# EAGLE design V2c (EAGLE 6.5.0)
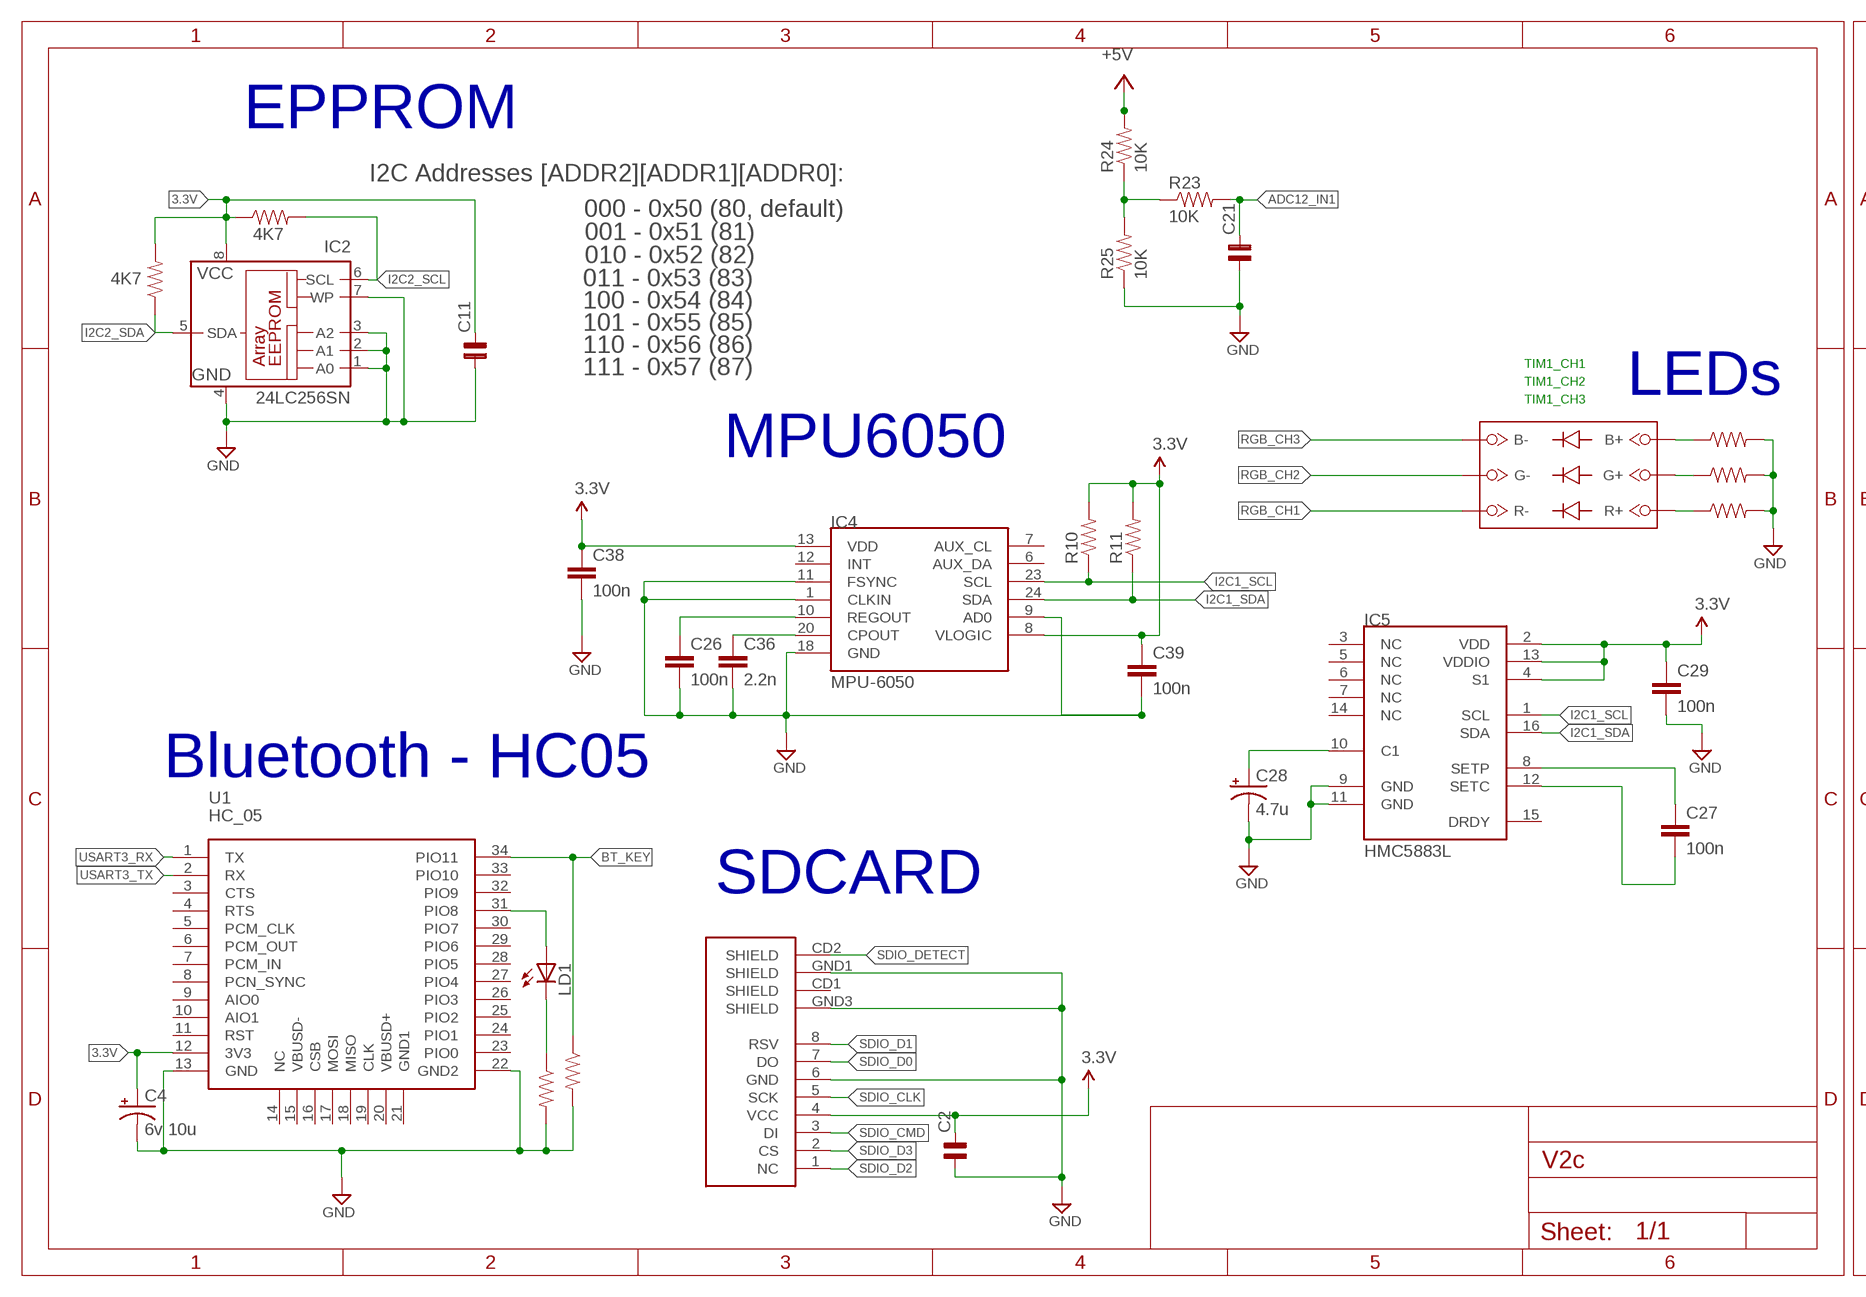
[diagram p0: schematic, sheet 1, part 1 of 2]
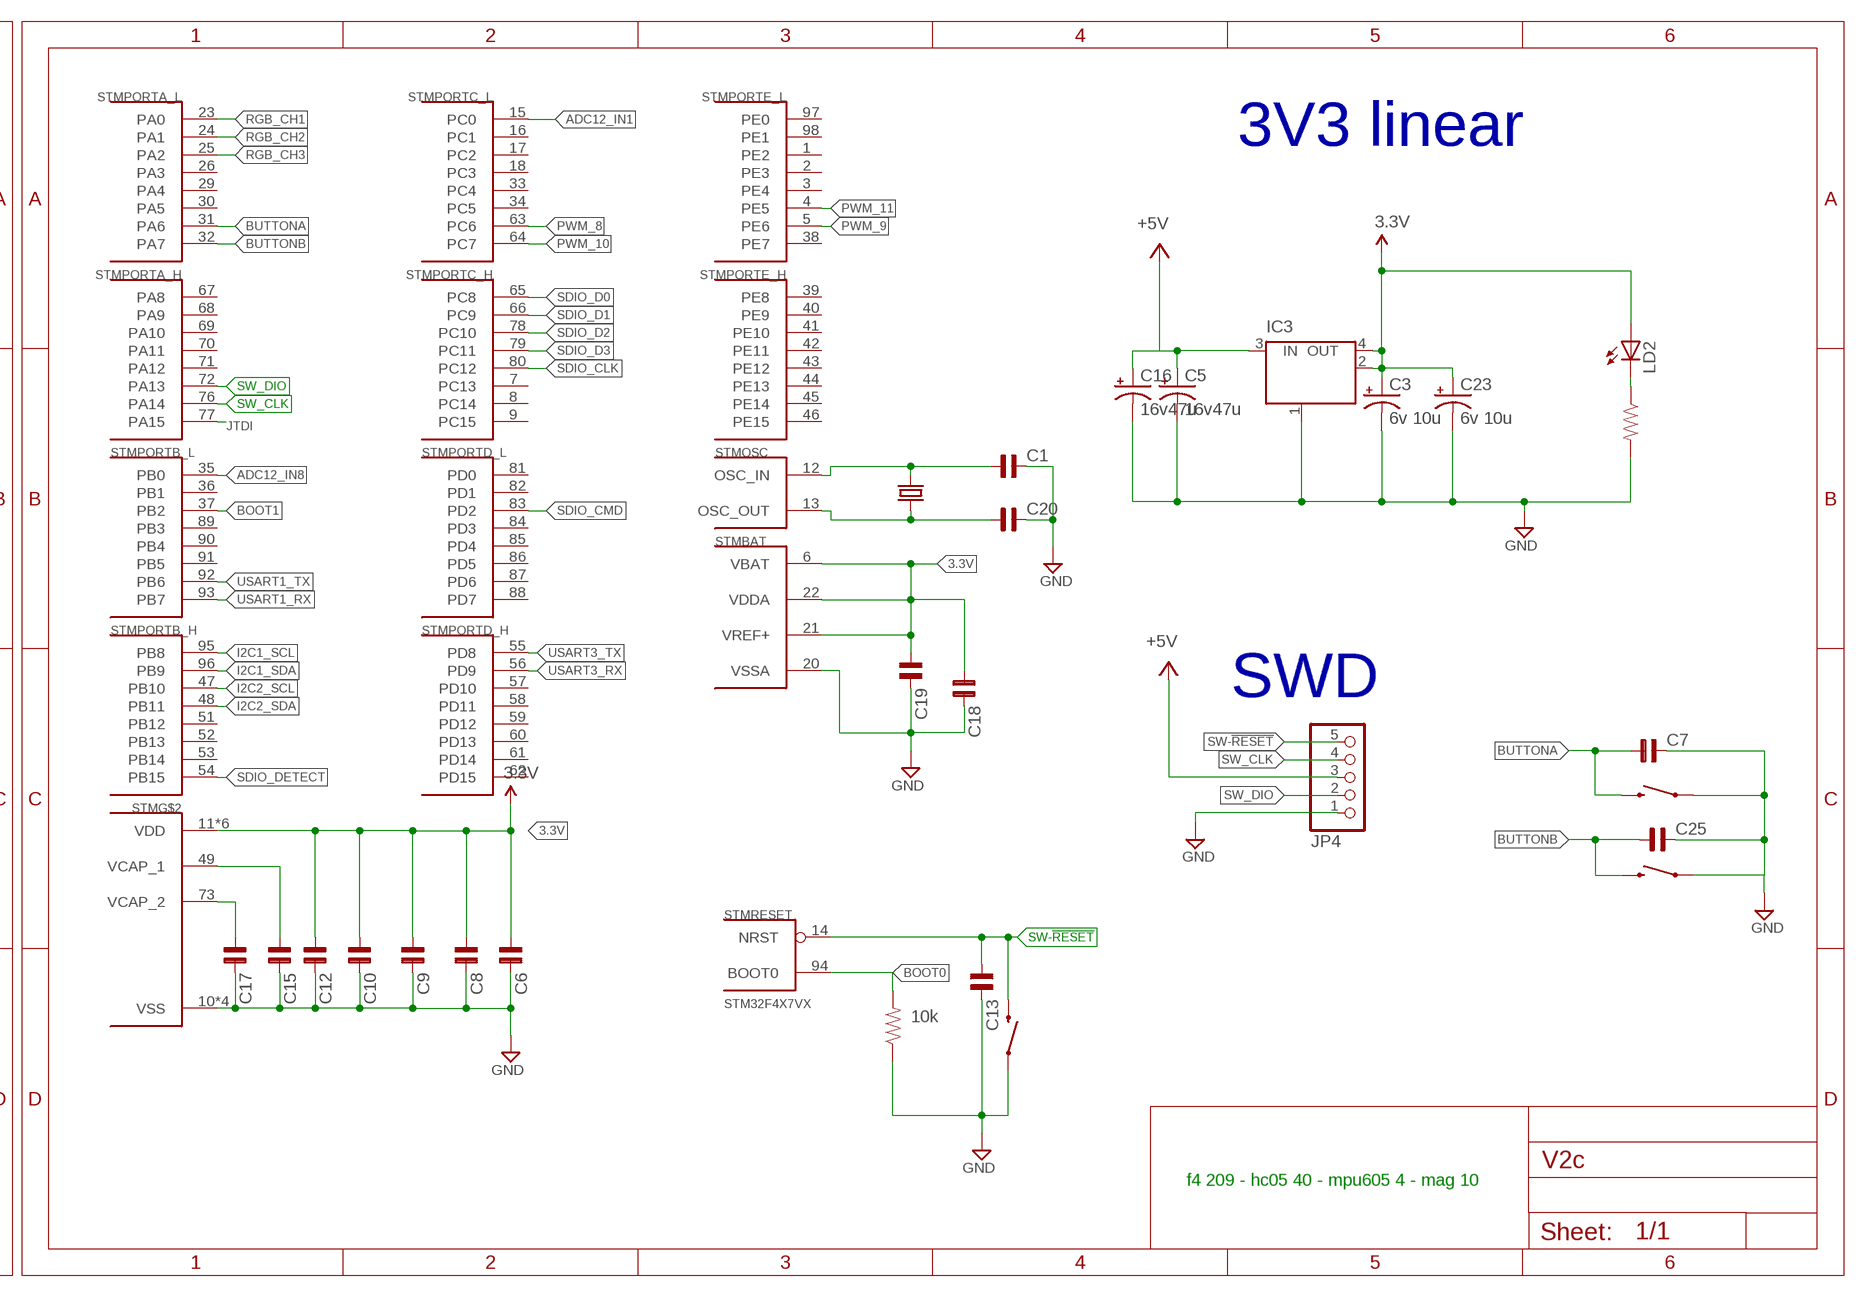
[diagram p1: schematic, sheet 1, part 2 of 2]

## Parts
C1  C-NP-SMD-0603  [C-0603]
C2  C-NP-SMD-0603  [C-0603]
C3  6v 10u  CPOL-USSMCC  [SMC_C]
C4  6v 10u  CPOL-USSMCA  [SMC_A]
C5  16v47u  CPOL-USSMCC  [SMC_C]
C6  C-NP-SMD-0603  [C-0603]
C7  C-NP-SMD-0603  [C-0603]
C8  C-NP-SMD-0603  [C-0603]
C9  C-NP-SMD-0603  [C-0603]
C10  C-NP-SMD-0603  [C-0603]
C11  C-NP-SMD-0603  [C-0603]
C12  C-NP-SMD-0603  [C-0603]
C13  C-NP-SMD-0603  [C-0603]
C15  C-NP-SMD-0603  [C-0603]
C16  16v47u  CPOL-USSMCC  [SMC_C]
C17  C-NP-SMD-0603  [C-0603]
C18  C-NP-SMD-0603  [C-0603]
C19  C-NP-SMD-0603  [C-0603]
C20  C-NP-SMD-0603  [C-0603]
C21  C-NP-SMD-0603  [C-0603]
C23  6v 10u  CPOL-USSMCC  [SMC_C]
C25  C-NP-SMD-0603  [C-0603]
C26  100n  SPARKFUN_CAP0603-CAP  [SPARKFUN_0603-CAP]
C27  100n  SPARKFUN_CAP0603-CAP  [SPARKFUN_0603-CAP]
C28  4.7u  CPOL-USSMCA  [SMC_A]
C29  100n  SPARKFUN_CAP0603-CAP  [SPARKFUN_0603-CAP]
C36  2.2n  SPARKFUN_CAP0603-CAP  [SPARKFUN_0603-CAP]
C38  100n  SPARKFUN_CAP0603-CAP  [SPARKFUN_0603-CAP]
C39  100n  SPARKFUN_CAP0603-CAP  [SPARKFUN_0603-CAP]
IC2  24LC256SN  [SO-08]
IC3  LINEAR_MC33269ST-3.3T3  [LINEAR_SOT223]
IC4  MPU-6050  TESTING_MPU-6050-1  [TESTING_QFN-24-4MM2]
IC5  HMC5883L  SPARKFUN_HMC5883LSMD  [SPARKFUN_16LPCC]
JP4  PINHD-1X5_2.54-90°  [1X05/90]
LD1  LEDCHIPLED_0603  [CHIPLED_0603]
LD2  LEDCHIPLED_0603  [CHIPLED_0603]
R1  10K  SPARKFUN_RESISTOR0603-RES  [SPARKFUN_0603-RES]
R2  10K  SPARKFUN_RESISTOR0603-RES  [SPARKFUN_0603-RES]
R3  10K  SPARKFUN_RESISTOR0603-RES  [SPARKFUN_0603-RES]
R5  10K  SPARKFUN_RESISTOR0603-RES  [SPARKFUN_0603-RES]
R6  10K  SPARKFUN_RESISTOR0603-RES  [SPARKFUN_0603-RES]
R7  10k  SPARKFUN_RESISTOR0603-RES  [SPARKFUN_0603-RES]
R9  10K  SPARKFUN_RESISTOR0603-RES  [SPARKFUN_0603-RES]
R10  SPARKFUN_RESISTOR0603-RES  [SPARKFUN_0603-RES]
R11  SPARKFUN_RESISTOR0603-RES  [SPARKFUN_0603-RES]
R15  4K7  SPARKFUN_RESISTOR0603-RES  [SPARKFUN_0603-RES]
R16  4K7  SPARKFUN_RESISTOR0603-RES  [SPARKFUN_0603-RES]
R23  10K  SPARKFUN_RESISTOR0603-RES  [SPARKFUN_0603-RES]
R24  10K  SPARKFUN_RESISTOR0603-RES  [SPARKFUN_0603-RES]
R25  10K  SPARKFUN_RESISTOR0603-RES  [SPARKFUN_0603-RES]
S1  RESET  SWITCH-MOMENTARY-2-SMD-1101NE  [TACTILE-SWITCH-1101NE]
S2  RESET  SWITCH-MOMENTARY-2-SMD-1101NE  [TACTILE-SWITCH-1101NE]
S4  RESET  SWITCH-MOMENTARY-2-SMD-1101NE  [TACTILE-SWITCH-1101NE]
SDCARD2  microSD Socket  USD-SOCKETNEW  [MICRO-SD-SOCKET-PP]
STM  STM32F4X7VX  [TQFP100]
U1  HC_05  [BLUETOOTH_SMD]
U$12  RGB_LED  [SMD]
Y1  CRYSTALHC49US  [HC49US]

## Nets
3.3V: C2.2 C3.+ C4.+ C6.1 C8.1 C9.1 C10.1 C11.2 C12.1 C18.1 C19.1 C23.+ C29.1 C38.1 C39.1 IC2.8(VCC) IC3.2(OUT) IC3.4(OUT) IC4.8(VLOGIC) IC4.13(VDD) IC5.2(VDD) IC5.4(S1) IC5.13(VDDIO) LD2.A R10.2 R11.2 R15.1 R16.2 SDCARD2.4(VCC) STM.6(BAT:VBAT) STM.11(VDD) STM.19(VDD) STM.21(BAT:VREF+) STM.22(BAT:VDDA) STM.28(VDD) STM.50(VDD) STM.75(VDD) STM.100(VDD) U1.12(3V3)
+5V: C5.+ C16.+ IC3.3(IN) JP4.3 R24.2
ADC12_IN1: C21.2 R23.2 STM.15(PORTC_L:PC0)
ADC12_IN8: STM.35(PORTB_L:PB0)
BOOT0: R7.2 STM.94(RESET:BOOT0)
BOOT1: STM.37(PORTB_L:PB2)
BT_KEY: R5.1 U1.34(PIO11)
BUTTONA: C7.1 S4.P$2 STM.31(PORTA_L:PA6)
BUTTONB: C25.1 S2.P$2 STM.32(PORTA_L:PA7)
GND: C1.2 C2.1 C3.- C4.- C5.- C6.2 C7.2 C8.2 C9.2 C10.2 C11.1 C12.2 C13.2 C15.2 C16.- C17.2 C18.2 C19.2 C20.2 C21.1 C23.- C25.2 C26.2 C28.- C29.2 C36.2 C38.2 C39.2 IC2.1(A0) IC2.2(A1) IC2.3(A2) IC2.4(GND) IC2.7(WP) IC3.1(GND/ADJ) IC4.1(CLKIN) IC4.9(AD0) IC4.11(FSYNC) IC4.18(GND) IC5.9(GND) IC5.11(GND) JP4.1 R1.2 R2.2 R3.2 R5.2 R6.2 R7.1 R9.2 R25.1 S1.P$1 S2.P$1 S4.P$1 SDCARD2.6(GND) SDCARD2.GND1(SHIELD) SDCARD2.GND3(SHIELD) STM.10(VSS) STM.20(BAT:VSSA) STM.27(VSS) STM.74(VSS) STM.99(VSS) U1.13(GND) U1.22(GND2)
I2C1_SCL: IC4.23(SCL) IC5.1(SCL) R10.1 STM.95(PORTB_H:PB8)
I2C1_SDA: IC4.24(SDA) IC5.16(SDA) R11.1 STM.96(PORTB_H:PB9)
I2C2_SCL: IC2.6(SCL) R15.2 STM.47(PORTB_H:PB10)
I2C2_SDA: IC2.5(SDA) R16.1 STM.48(PORTB_H:PB11)
JTDI: STM.77(PORTA_H:PA15)
N$1: C1.1 STM.12(OSC:OSC_IN) Y1.2
N$2: R2.1 U$12.B+
N$3: C26.1 IC4.10(REGOUT)
N$4: LD1.A U1.31(PIO8)
N$5: LD1.C R9.1
N$6: R6.1 U$12.R+
N$7: R3.1 U$12.G+
N$8: C36.1 IC4.20(CPOUT)
N$10: C27.1 IC5.8(SETP)
N$11: LD2.C R1.1
N$12: C28.+ IC5.10(C1)
N$13: C27.2 IC5.12(SETC)
N$27: R23.1 R24.1 R25.2
N$29: C20.1 STM.13(OSC:OSC_OUT) Y1.1
N$31: C17.1 STM.73(VCAP_2)
N$32: C15.1 STM.49(VCAP_1)
PWM_8: STM.63(PORTC_L:PC6)
PWM_9: STM.5(PORTE_L:PE6)
PWM_10: STM.64(PORTC_L:PC7)
PWM_11: STM.4(PORTE_L:PE5)
RGB_CH1: STM.23(PORTA_L:PA0) U$12.R-
RGB_CH2: STM.24(PORTA_L:PA1) U$12.G-
RGB_CH3: STM.25(PORTA_L:PA2) U$12.B-
SDIO_CLK: SDCARD2.5(SCK) STM.80(PORTC_H:PC12)
SDIO_CMD: SDCARD2.3(DI) STM.83(PORTD_L:PD2)
SDIO_D0: SDCARD2.7(DO) STM.65(PORTC_H:PC8)
SDIO_D1: SDCARD2.8(RSV) STM.66(PORTC_H:PC9)
SDIO_D2: SDCARD2.1(NC) STM.78(PORTC_H:PC10)
SDIO_D3: SDCARD2.2(CS) STM.79(PORTC_H:PC11)
SDIO_DETECT: SDCARD2.CD2(SHIELD) STM.54(PORTB_H:PB15)
SW-!RESET: C13.1 JP4.5 S1.P$2 STM.14(RESET:NRST)
SW_CLK: JP4.4 STM.76(PORTA_H:PA14)
SW_DIO: JP4.2 STM.72(PORTA_H:PA13)
USART1_RX: STM.93(PORTB_L:PB7)
USART1_TX: STM.92(PORTB_L:PB6)
USART3_RX: STM.56(PORTD_H:PD9) U1.1(TX)
USART3_TX: STM.55(PORTD_H:PD8) U1.2(RX)
Unconnected: IC4.6(AUX_DA) IC4.7(AUX_CL) IC4.12(INT) IC5.3(NC) IC5.5(NC) IC5.6(NC) IC5.7(NC) IC5.14(NC) IC5.15(DRDY) SDCARD2.CD1(SHIELD) STM.1(PORTE_L:PE2) STM.2(PORTE_L:PE3) STM.3(PORTE_L:PE4) STM.7(PORTC_H:PC13) STM.8(PORTC_H:PC14) STM.9(PORTC_H:PC15) STM.16(PORTC_L:PC1) STM.17(PORTC_L:PC2) STM.18(PORTC_L:PC3) STM.26(PORTA_L:PA3) STM.29(PORTA_L:PA4) STM.30(PORTA_L:PA5) STM.33(PORTC_L:PC4) STM.34(PORTC_L:PC5) STM.36(PORTB_L:PB1) STM.38(PORTE_L:PE7) STM.39(PORTE_H:PE8) STM.40(PORTE_H:PE9) STM.41(PORTE_H:PE10) STM.42(PORTE_H:PE11) STM.43(PORTE_H:PE12) STM.44(PORTE_H:PE13) STM.45(PORTE_H:PE14) STM.46(PORTE_H:PE15) STM.51(PORTB_H:PB12) STM.52(PORTB_H:PB13) STM.53(PORTB_H:PB14) STM.57(PORTD_H:PD10) STM.58(PORTD_H:PD11) STM.59(PORTD_H:PD12) STM.60(PORTD_H:PD13) STM.61(PORTD_H:PD14) STM.62(PORTD_H:PD15) STM.67(PORTA_H:PA8) STM.68(PORTA_H:PA9) STM.69(PORTA_H:PA10) STM.70(PORTA_H:PA11) STM.71(PORTA_H:PA12) STM.81(PORTD_L:PD0) STM.82(PORTD_L:PD1) STM.84(PORTD_L:PD3) STM.85(PORTD_L:PD4) STM.86(PORTD_L:PD5) STM.87(PORTD_L:PD6) STM.88(PORTD_L:PD7) STM.89(PORTB_L:PB3) STM.90(PORTB_L:PB4) STM.91(PORTB_L:PB5) STM.97(PORTE_L:PE0) STM.98(PORTE_L:PE1) U1.3(CTS) U1.4(RTS) U1.5(PCM_CLK) U1.6(PCM_OUT) U1.7(PCM_IN) U1.8(PCN_SYNC) U1.9(AIO0) U1.10(AIO1) U1.11(RST) U1.14(NC) U1.15(VBUSD-) U1.16(CSB) U1.17(MOSI) U1.18(MISO) U1.19(CLK) U1.20(VBUSD+) U1.21(GND1) U1.23(PIO0) U1.24(PIO1) U1.25(PIO2) U1.26(PIO3) U1.27(PIO4) U1.28(PIO5) U1.29(PIO6) U1.30(PIO7) U1.32(PIO9) U1.33(PIO10)

## Notes on the sheet
- EPPROM | 3V3 linear
- I2C Addresses [ADDR2][ADDR1][ADDR0]:
- 000 - 0x50 (80, default)
- 001 - 0x51 (81)
- 010 - 0x52 (82)
- 011 - 0x53 (83)
- 100 - 0x54 (84)
- 101 - 0x55 (85)
- 110 - 0x56 (86)
- TIM1_CH1
- 111 - 0x57 (87)
- TIM1_CH2
- LEDs
- TIM1_CH3
- MPU6050
- SWD
- Bluetooth - HC05
- SDCARD
- f4 209 - hc05 40 - mpu605 4 - mag 10
- TJA1040

## Library data of the parts
C1 C2 C6-C13 C15 C17-C21 C25 = cap-pan40:C-NP: NON-POLARIZED FILM/CHIP
C3-C5 C16 C23 C28 = rcl:CPOL-US: POLARIZED CAPACITOR, American symbol
C26 C27 C29 C36 C38 C39 = Helios_RLC:SPARKFUN_CAP: Capacitor Standard 0603 ceramic capacitor, and 0.1" leaded capacitor.
IC2 = microchip:24*: Serial EEPROM I2C; DIGIKEY: 24LC256-E/SN-ND; MF: MICROCHIP; MPN: 24LC256-I/SN; OC_FARNELL: 9757996; OC_NEWARK: 27C9144
IC3 = Robotech_Other:LINEAR_MC33269ST*: Adjustable Output Low Dropout Voltage Regulator 800 mA Source: http://www.onsemi.com/pub/Collateral/MC33269-D.PDF
IC4 = Helios_IMU:TESTING_MPU-6050
IC5 = Helios_IMU:SPARKFUN_HMC5883L: 3 Axis Digital Compass IC
JP4 = pinhead-1:PINHD-1X5: PIN HEADER
LD1 LD2 = led:LED: LED OSRAM: - CHIPLED LG R971, LG N971, LY N971, LG Q971, LY Q971, LO R971, LY R971 LH N974, LH R974 LS Q976, LO Q976, LY Q976 LO Q996 - Hyper CHIPLED LW Q18S LB Q993, LB Q99A, LB R99A - SideLED LS A670, LO A670, LY A670, LG A670, LP A670 LB A673, LV A673, LT A673, LW A673 LH A674 LY A675 LS A676, LA A676, LO A676, LY A676, LW A676 LS A679, LY A679, LG A679 - Hyper Micro SIDELED® LS Y876, LA Y876, LO Y876, LY Y876 LT Y87S - SmartLED LW L88C, LW L88S LB L89C, LB L89S, LG L890 LS L89K, LO L89K, LY L89K LS L896, LA L896, LO L896, LY L896 - TOPLED LS T670, LO T670, LY T670, LG T670, LP T670 LSG T670, LSP T670, LSY T670, LOP T670, LYG T670 LG T671, LOG T671, LSG T671 LB T673, LV T673, LT T673, LW T673 LH T674 LS T676, LA T676, LO T676, LY T676, LB T676, LH T676, LSB T676, LW T676 LB T67C, LV T67C, LT T67C, LS T67K, LO T67K, LY T67K, LW E67C LS E67B, LA E67B, LO E67B, LY E67B, LB E67C, LV E67C, LT E67C LW T67C LS T679, LY T679, LG T679 LS T770, LO T770, LY T770, LG T770, LP T770 LB T773, LV T773, LT T773, LW T773 LH T774 LS E675, LA E675, LY E675, LS T675 LS T776, LA T776, LO T776, LY T776, LB T776 LHGB T686 LT T68C, LB T68C - Hyper Mini TOPLED® LB M676 - Mini TOPLED Santana® LG M470 LS M47K, LO M47K, LY M47K Source: http://www.osram.convergy.de/
R1-R3 R5-R7 R9 R15 R16 R23-R25 = Robotech_RCL:SPARKFUN_RESISTOR: Resistor Basic schematic elements and footprints for 0603, 1206, and PTH resistors.
R10 R11 = Helios_RLC:SPARKFUN_RESISTOR: Resistor Basic schematic elements and footprints for 0603, 1206, and PTH resistors.
S1 S2 S4 = pixhawk2:SWITCH-MOMENTARY-2; PARTNO: EVQ-P7J01P
SDCARD2 = SparkFun:USD-SOCKET: microSD Socket Push-push type uSD socket. Schematic element and footprint production proven. Spark Fun Electronics SKU : PRT-00127. tDoc lines correctly indicate media card edge positions when inserting (unlocked, locked, depressed).
STM = pixhawk2:STM32F4X7VX: STM32F4X7VX 100 pin LQFP STM32F407VE - 512 KB flash, no crypto STM32F407VG - 1 MB flash, no crypto STM32F417VE - 512 KB flash, with crypto STM32F417VG - 1 MB flash, with crypto; PARTNO: STM32F427VI
U1 = SerialPortBluetooth:HC_05
U$12 = RGB_LED:RGB_LED
Y1 = SparkFun-FreqCtrl:CRYSTAL: Various standard crystals. Proven footprints. Spark Fun Electronics SKU : COM-00534

## Net classes
1 power: width 0.15 mm, drill 0.2 mm, clearance 0.152 mm

## Board
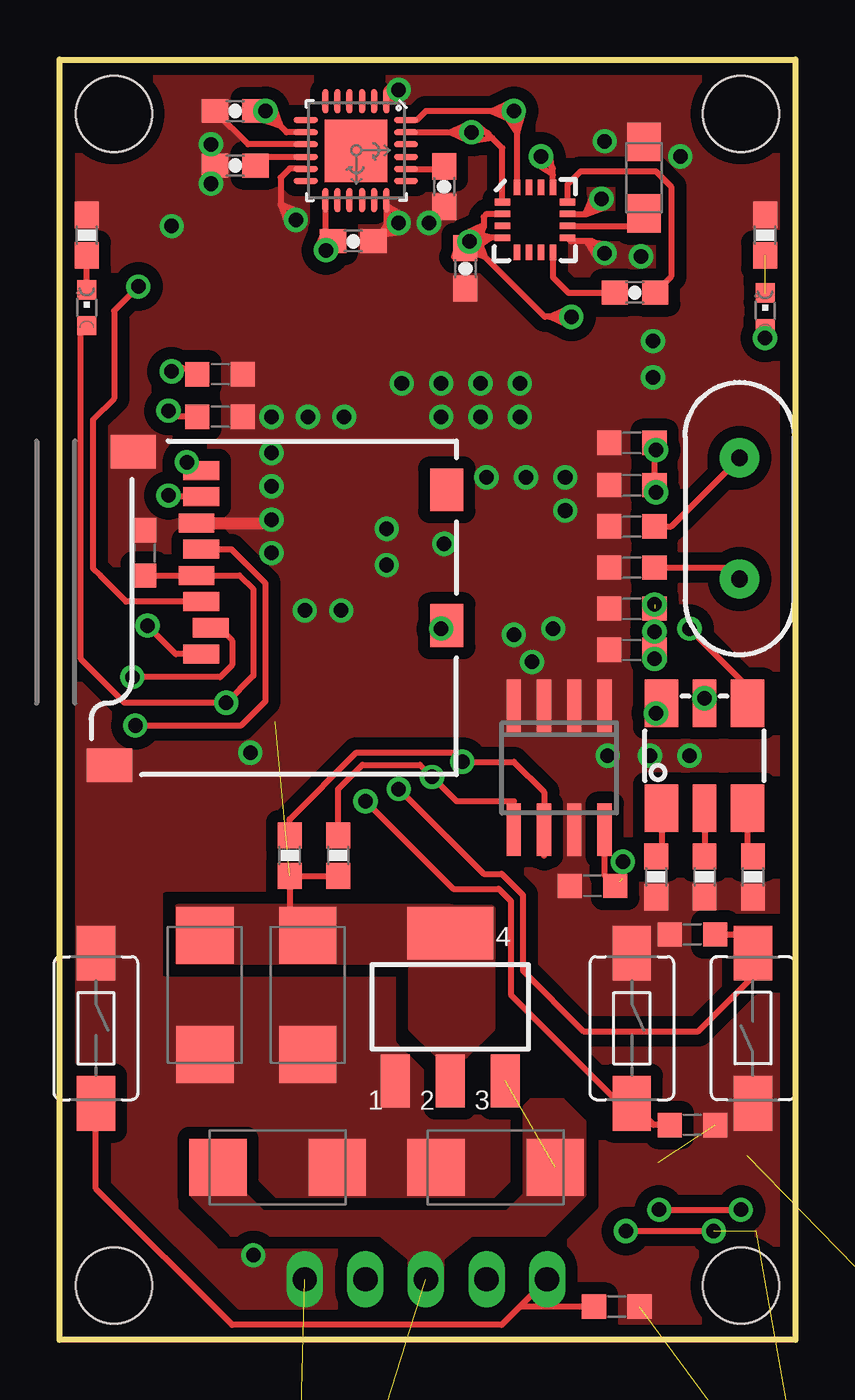
[diagram p2: board, top side]
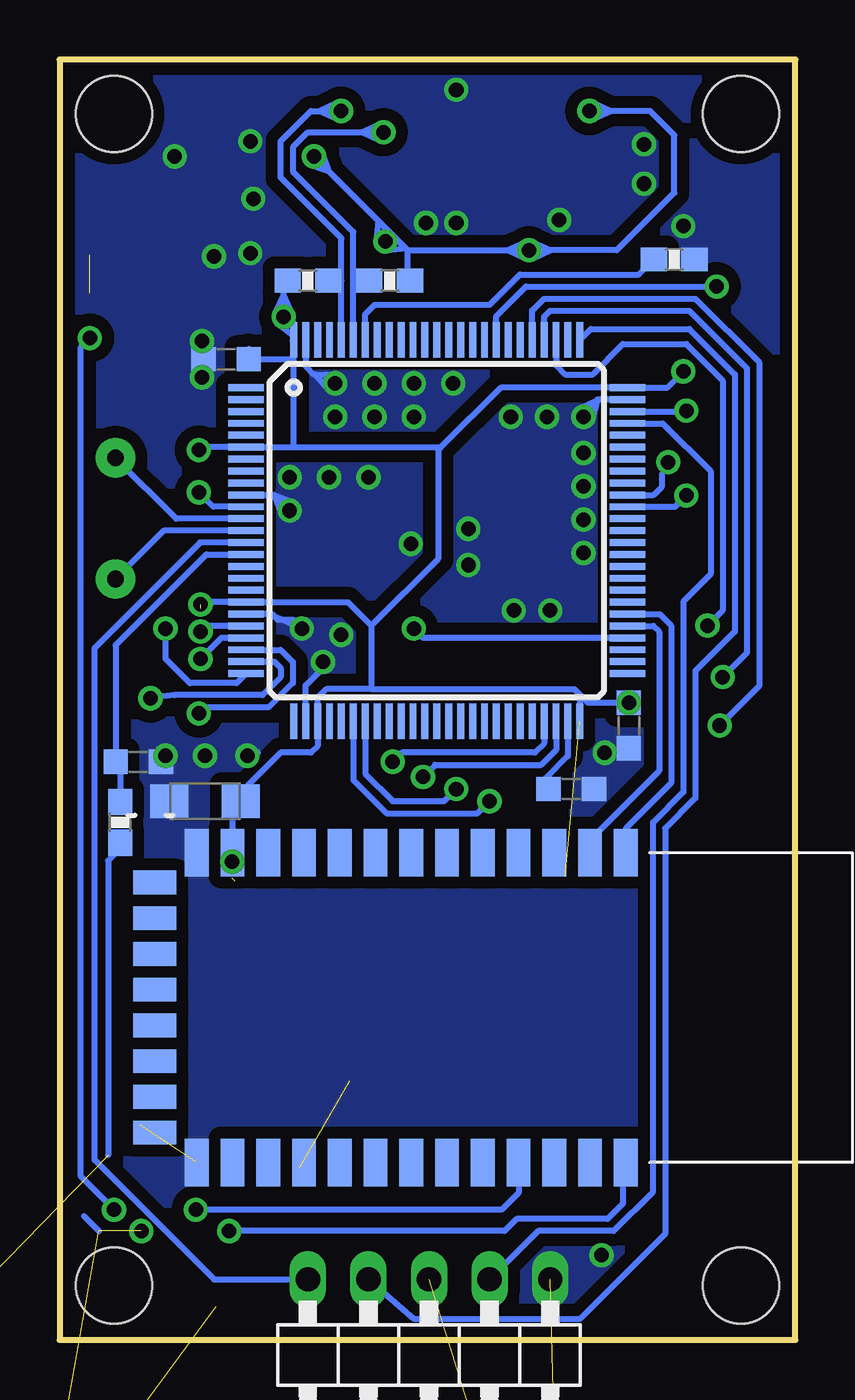
[diagram p3: board, bottom side, seen from below]

Size 30.86 x 53.72 mm. Coordinates in mm from the lower left corner, seen from the top.
Outline: 30.86,0 0,0 0,53.72 30.86,53.72 30.86,0
Copper layers (1*16): Top 0.035mm / dielectric 1.5mm / Bottom 0.035mm
Design rules "default *": minimum track width 10mil, minimum drill 24mil, track to track 8mil, track to pad 8mil, pad to pad 8mil, via to via 10mil, smd to smd 8mil, copper to edge 20mil, drill to drill 10mil, minimum pad ring 10mil, minimum via ring 8mil, stop-mask expansion 0mil, vias tented up to drill 100mil, thermal gap 10mil
Holes 3.2 mm at -91.19,11.3 -91.19,54.48 -61.47,54.48 28.58,2.29 -74.93,5.84 2.29,2.29 2.29,51.43 28.58,51.43
tKeepout: area 25.1,-1.2 to 32.1,5.8; area -78.4,2.3 to -71.4,9.3; area -1.2,-1.2 to 5.8,5.8; area -1.2,47.9 to 5.8,54.9; area 25.1,47.9 to 32.1,54.9

### Footprints (pad centres in the part's own frame; a part is rotated, then mirrored left to right if it is on the bottom)
C-0603 = smd 1.016 x 1.016: 1 -0.953,0; 2 0.953,0
SMC_C = smd 2.4 x 2.4: + -2.5,0; - 2.5,0
SMC_A = smd 1.6 x 1.4: + -1.5,0; - 1.5,0
SPARKFUN_0603-CAP = smd 1.1 x 1: 1 -0.85,0; 2 0.85,0
SO-08 = smd 0.6 x 2.2: 1 -1.905,-2.6; 2 -0.635,-2.6; 3 0.635,-2.6; 4 1.905,-2.6; 5 1.905,2.6; 6 0.635,2.6; 7 -0.635,2.6; 8 -1.905,2.6
LINEAR_SOT223 = smd 1.219 x 2.235: 1 -2.311,-3.099; 2 0,-3.099; 3 2.311,-3.099 | smd 3.6 x 2.2: 4 0,3.099
TESTING_QFN-24-4MM2 = smd 1.016 x 0.254: 1 -2.066,1.257; 2 -2.066,0.75; 3 -2.066,0.247; 4 -2.066,-0.287; 5 -2.066,-0.792; 6 -2.066,-1.297; 13 2.086,-1.297; 14 2.086,-0.792; 15 2.086,-0.287; 16 2.086,0.247; 17 2.086,0.75; 18 2.086,1.257 | smd 0.254 x 1.016: 7 -1.267,-2.122; 8 -0.762,-2.122; 9 -0.258,-2.122; 10 0.278,-2.122; 11 0.78,-2.122; 12 1.287,-2.122; 19 1.287,2.082; 20 0.78,2.082; 21 0.278,2.082; 22 -0.258,2.082; 23 -0.762,2.082; 24 -1.267,2.082 | smd 2.616 x 2.616: P$1 0.02,-0.01
SPARKFUN_16LPCC = smd 0.65 x 0.28: 1 -1.37,0.75; 2 -1.37,0.25; 3 -1.37,-0.25; 4 -1.37,-0.75; 9 1.37,-0.75; 10 1.37,-0.25; 11 1.37,0.25; 12 1.37,0.75 | smd 0.28 x 0.65: 5 -0.75,-1.37; 6 -0.25,-1.37; 7 0.25,-1.37; 8 0.75,-1.37; 13 0.75,1.37; 14 0.25,1.37; 15 -0.25,1.37; 16 -0.75,1.37
1X05/90 = drill 1.016 long: 1 -5.08,-3.81; 2 -2.54,-3.81; 3 0,-3.81; 4 2.54,-3.81; 5 5.08,-3.81
CHIPLED_0603 = smd 0.8 x 0.8: A 0,-0.75; C 0,0.75
SPARKFUN_0603-RES = smd 1.1 x 1: 1 -0.85,0; 2 0.85,0
TACTILE-SWITCH-1101NE = smd 2.3 x 1.6: P$1 -3.15,0; P$2 3.15,0
MICRO-SD-SOCKET-PP = smd 0.8 x 1.5: 1 -8.94,10.7; 2 -7.84,10.3; 3 -6.74,10.7; 4 -5.64,10.9; 5 -4.54,10.7; 6 -3.44,10.9; 7 -2.34,10.7; 8 -1.24,10.7 | smd 1.8 x 1.4: CD1 -2.05,0.4; CD2 -7.75,0.4 | smd 1.4 x 1.9: GND1 -13.6,14.55; GND3 -0.45,13.55
TQFP100 = smd 1.5 x 0.29: 1 -8,6; 2 -8,5.5; 3 -8,5; 4 -8,4.5; 5 -8,4; 6 -8,3.5; 7 -8,3; 8 -8,2.5; 9 -8,2; 10 -8,1.5; 11 -8,1; 12 -8,0.5; 13 -8,0; 14 -8,-0.5; 15 -8,-1; 16 -8,-1.5; 17 -8,-2; 18 -8,-2.5; 19 -8,-3; 20 -8,-3.5; 21 -8,-4; 22 -8,-4.5; 23 -8,-5; 24 -8,-5.5; 25 -8,-6; 51 8,-6; 52 8,-5.5; 53 8,-5; 54 8,-4.5; 55 8,-4; 56 8,-3.5; 57 8,-3; 58 8,-2.5; 59 8,-2; 60 8,-1.5; 61 8,-1; 62 8,-0.5; 63 8,0; 64 8,0.5; 65 8,1; 66 8,1.5; 67 8,2; 68 8,2.5; 69 8,3; 70 8,3.5; 71 8,4; 72 8,4.5; 73 8,5; 74 8,5.5; 75 8,6 | smd 0.29 x 1.5: 26 -6,-8; 27 -5.5,-8; 28 -5,-8; 29 -4.5,-8; 30 -4,-8; 31 -3.5,-8; 32 -3,-8; 33 -2.5,-8; 34 -2,-8; 35 -1.5,-8; 36 -1,-8; 37 -0.5,-8; 38 0,-8; 39 0.5,-8; 40 1,-8; 41 1.5,-8; 42 2,-8; 43 2.5,-8; 44 3,-8; 45 3.5,-8; 46 4,-8; 47 4.5,-8; 48 5,-8; 49 5.5,-8; 50 6,-8; 76 6,8; 77 5.5,8; 78 5,8; 79 4.5,8; 80 4,8; 81 3.5,8; 82 3,8; 83 2.5,8; 84 2,8; 85 1.5,8; 86 1,8; 87 0.5,8; 88 0,8; 89 -0.5,8; 90 -1,8; 91 -1.5,8; 92 -2,8; 93 -2.5,8; 94 -3,8; 95 -3.5,8; 96 -4,8; 97 -4.5,8; 98 -5,8; 99 -5.5,8; 100 -6,8
BLUETOOTH_SMD = smd 2 x 1: 1 0,0; 2 0,-1.5; 3 0,-3; 4 0,-4.5; 5 0,-6; 6 0,-7.5; 7 0,-9; 8 0,-10.5; 9 0,-12; 10 0,-13.5; 11 0,-15; 12 0,-16.5; 13 0,-18; 22 13,-18; 23 13,-16.5; 24 13,-15; 25 13,-13.5; 26 13,-12; 27 13,-10.5; 28 13,-9; 29 13,-7.5; 30 13,-6; 31 13,-4.5; 32 13,-3; 33 13,-1.5; 34 13,0 | smd 1 x 1.8: 14 1.25,-19.75; 15 2.75,-19.75; 16 4.25,-19.75; 17 5.75,-19.75; 18 7.25,-19.75; 19 8.75,-19.75; 20 10.25,-19.75; 21 11.75,-19.75
SMD = smd 1.99 x 1.4: B+ -2.2,-1.8; B- 2.2,-1.8; R+ -2.2,1.8; R- 2.2,1.8 | smd 1.99 x 1: G+ -2.2,0; G- 2.2,0
HC49US = drill 0.7 pad 1.651: 1 -2.54,0; 2 2.54,0

### Placement (x,y rotation side)
C1  24,34.14 180 top
C2  3.56,33.02 270 top
C3  10.41,14.48 270 top
C4  24.77,22.61 180 bottom
C5  18.29,7.24 180 top
C6  24,28.96 180 top
C7  26.54,9.02 0 top
C8  24,30.68 180 top
C9  24,35.86 180 top
C10  24,37.64 180 top
C11  22.35,19.05 0 top
C12  23.88,41.15 180 bottom
C13  23.37,1.4 0 top
C15  9.4,23.11 0 bottom
C16  9.14,7.24 0 top
C17  6.73,38.73 0 top
C18  6.98,25.78 270 bottom
C19  6.73,40.51 0 top
C20  24,32.41 180 top
C21  27.56,24.26 180 bottom
C23  6.1,14.48 270 top
C25  26.54,17.02 180 top
C26  7.37,49.28 180 top
C27  24.13,43.94 0 top
C28  24.51,48.77 90 top
C29  17.02,44.96 270 top
C36  16.13,48.39 270 top
C38  12.32,46.1 0 top
C39  7.37,51.56 180 top
IC2  20.95,24 180 top
IC3  16.38,13.97 0 top
IC4  12.45,49.91 270 top
IC5  19.94,46.99 0 top
JP4  15.37,-1.27 180 bottom
LD1  29.59,43.18 0 top
LD2  1.14,43.31 0 top
R1  1.14,46.35 90 top
R2  29.08,19.43 270 top
R3  27.05,19.43 270 top
R5  32.89,-11.43 0 top  (outside the outline)
R6  25.02,19.43 270 top
R7  5.08,45.34 180 bottom
R9  29.59,46.35 90 top
R10  17.02,44.45 0 bottom
R11  20.45,44.45 180 bottom
R15  9.65,20.32 90 top
R16  11.68,20.32 270 top
R23  28.32,21.72 90 bottom
R24  9.02,-15.11 0 top  (outside the outline)
R25  9.02,-13.08 180 top  (outside the outline)
S1  1.52,13.08 270 top
S2  29.08,13.08 90 top
S4  24,13.08 270 top
SDCARD2  16.64,37.72 90 top
STM  15.04,33.96 0 bottom
U1  7.11,20.45 270 bottom
U$12  27.05,24.51 90 top
Y1  28.52,34.46 90 top

### Tracks (layer width: path | path; a pad name or v marks a point on that pad's centre or on a via)
3.3V  (via drill 0.61)  (3 unrouted)
  Top 0.254: IC5.13 20.69,48.89 | 20.69,48.89 20.69,49.16 v20.19,49.66 | v8.64,51.56 C39.1 | IC4.8 9.53,50.67 9.28,50.91 | 9.28,50.91 | 9.28,50.91 v8.64,51.56 | v17.2,46.09 17.35,46.24 17.4,46.24 | v21.46,42.93 20.55,42.93 | 20.55,42.93 20.36,42.93 17.84,45.44 | 17.84,45.44 | 17.84,45.44 v17.2,46.09 | IC5.4 18.1,46.24 | 18.1,46.24 17.4,46.24 | IC5.2 17.9,47.24 17.78,47.12 17.78,46.79 | 17.78,46.79 17.78,46.67 v17.2,46.09 | IC4.13 11.15,46.63 | 11.15,46.63 11.15,46.42 C38.1 11.68,46.32 11.68,46.35 11.18,45.85 v11.18,45.72 | C29.1 17.4,46.19 17.4,46.24 | 17.84,45.44 17.55,46.22 | 17.55,46.22 | 17.84,45.44 | 17.84,45.44 17.06,45.73 | v17.2,46.09 17.06,45.73 | 9.28,50.91 8.99,51.7 | 8.99,51.7 | 9.28,50.91 | 9.28,50.91 8.5,51.2 | v8.64,51.56 8.5,51.2 | 20.55,42.93 21.3,42.58 | 17.84,45.44 | 9.28,50.91 | 20.69,48.89 20.57,49.71 v20.19,49.66 | 20.69,48.89 19.99,49.34 v20.19,49.66 | 17.84,45.44 17.55,46.22 | 17.55,46.22 | v17.2,46.09 17.55,46.22 | 17.84,45.44 17.06,45.73 | v17.2,46.09 17.33,45.73 16.55,45.44 16.84,46.22 v17.2,46.09 | 17.84,45.44 17.55,46.22 | v17.2,46.09 17.55,46.22 | 17.84,45.44 17.06,45.73 | v17.2,46.09 17.06,45.73 | 18.1,46.24 17.3,46.45 v17.2,46.09 | 18.1,46.24 17.41,45.77 v17.2,46.09 | 17.78,46.79 17.03,46.43 v17.2,46.09 | 17.78,46.79 17.56,45.99 v17.2,46.09 | 9.28,50.91 8.99,51.7 | 8.99,51.7 | v8.64,51.56 8.99,51.7 | 9.28,50.91 8.5,51.2 | v8.64,51.56 8.6,51.18 7.77,51.27 8.38,51.84 v8.64,51.56 | 9.28,50.91 8.99,51.7 | v8.64,51.56 8.99,51.7 | 9.28,50.91 8.5,51.2 | v8.64,51.56 8.5,51.2 | 21.3,42.58 | 20.55,42.93 | 20.55,42.93 21.3,42.58 | v21.46,42.93 21.3,42.58 | 20.55,42.93 | 20.55,42.93 21.3,43.27 | 21.3,43.27 | 20.55,42.93 | 20.55,42.93 21.3,43.27 | v21.46,42.93 21.3,43.27
  Top 0.254: 20.55,42.93 21.3,42.58 | 21.3,42.58 | 20.55,42.93 21.3,42.58 | v21.46,42.93 21.3,42.58 | 20.55,42.93 21.3,43.27 | 21.3,43.27 | v21.46,42.93 21.3,43.27 | 20.55,42.93 21.3,42.58 | 20.55,42.93 21.3,43.27 | 20.55,42.93 21.3,42.58 | v21.46,42.93 21.3,42.58 | 20.55,42.93 21.3,43.27 | v21.46,42.93 21.3,43.27 | 11.15,46.63 10.83,45.87 v11.18,45.72 | 11.15,46.63 11.52,45.89 v11.18,45.72 | v25.02,35.56 25.02,35.8 C9.1 24.95,37.27 v25.02,37.34 25.02,37.58 C10.1 | v24.95,30.86 v24.95,29.72 C6.1 v24.95,28.58 | v4.7,40.64 4.95,40.89 C19.1 | C2.2 3.57,32.08 SDCARD2.4 7.55,32.08 8.13,31.5 8.13,27.88 C18.1 2.73,26.73 0.89,28.58 0.89,42.3 LD2.A | 23.5,19.24 C11.2 22.86,19.49 IC2.8 | 23.62,19.37 v23.62,20.07 | R16.2 R15.1 9.65,16.98 C3.+
  Bottom 0.254: STM.100 21.09,41.91 | 21.04,37.46 21.04,41.27 | 21.04,41.27 STM.100 | 14.99,37.46 14.99,37.34 | 21.04,37.46 STM.6 24.9,37.46 v25.02,37.34 | 14.87,37.46 12.37,39.96 STM.75 5.38,39.96 v4.7,40.64 | 14.87,37.46 14.99,37.34 | 21.04,41.27 21.17,41.15 C12.1 22.92,41.59 | 23.06,29.97 STM.21 24.72,29.96 v24.95,29.72 | 7.72,51.56 6.1,51.56 5.08,50.55 5.08,48.13 7.49,45.72 10.26,45.72 | 7.72,51.56 v8.64,51.56 | 21.17,44.32 21.59,44.32 21.46,44.19 21.46,43.84 | 16.26,45.72 16.26,44.54 R10.2 16.13,44.49 | 17.78,27.3 9.27,27.3 9.04,27.07 | 9.04,27.07 STM.50 | STM.100 21.04,42.11 | 21.04,42.11 21.04,42.5 v21.46,42.93 | v21.46,42.93 21.46,43.84 | R11.2 21.17,44.32 | 21.17,44.32 21.04,44.32 | v17.2,46.09 17.2,46.66 | 17.2,46.66 17.49,46.95 | 17.49,46.95 19.55,49.01 | 19.55,49.01 v20.19,49.66 | 16.26,45.72 16.33,45.79 | 16.33,45.79 17.2,46.66 | 10.26,45.72 v11.18,45.72 | 16.26,45.72 12.09,45.72 | 12.09,45.72 v11.18,45.72 | 7.72,51.56 8.48,51.22 | 21.46,43.84 21.12,43.09 | 10.26,45.72 11.02,45.37 | 21.12,43.09 | 12.09,45.72 | 12.09,45.72 11.34,46.07 | 11.34,46.07 | 19.55,49.01 | 19.55,49.01 20.33,49.3 | 20.33,49.3 | 19.55,49.01 | 19.55,49.01 19.84,49.79 | 19.84,49.79 | 19.55,49.01 19.84,49.79 | 19.84,49.79 | 19.55,49.01 20.33,49.3 | 20.33,49.3 | v20.19,49.66 20.33,49.3 | 19.55,49.01 19.84,49.79 | v20.19,49.66 19.84,49.79 | 19.55,49.01 20.33,49.3 | v20.19,49.66 20.33,49.3 | 19.55,49.01 19.84,49.79 | v20.19,49.66 19.84,49.79 | 17.49,46.95 16.92,46.35 v17.2,46.09 | 17.49,46.95 17.58,46.12 v17.2,46.09 | 16.33,45.79 17.16,45.71 v17.2,46.09 | 16.33,45.79 16.94,46.36 v17.2,46.09 | 8.48,51.22 | 7.72,51.56 | 7.72,51.56 8.48,51.22 | v8.64,51.56 8.48,51.22 | 7.72,51.56 | 7.72,51.56 8.48,51.91
  Bottom 0.254: 8.48,51.91 | 7.72,51.56 | 7.72,51.56 8.48,51.91 | v8.64,51.56 8.48,51.91 | 7.72,51.56 8.48,51.22 | 8.48,51.22 | 7.72,51.56 8.48,51.22 | v8.64,51.56 8.48,51.22 | 7.72,51.56 8.48,51.91 | 8.48,51.91 | v8.64,51.56 8.48,51.91 | 7.72,51.56 8.48,51.22 | 7.72,51.56 8.48,51.91 | 7.72,51.56 8.48,51.22 | v8.64,51.56 8.48,51.22 | 7.72,51.56 8.48,51.91 | v8.64,51.56 8.48,51.91 | 21.46,43.84 | 21.46,43.84 21.12,43.09 | v21.46,42.93 21.12,43.09 | 21.46,43.84 | 21.46,43.84 21.81,43.09 | 21.81,43.09 | 21.46,43.84 | 21.46,43.84 21.81,43.09 | v21.46,42.93 21.81,43.09 | 21.04,42.11 21.7,42.62 v21.46,42.93 | 21.04,42.11 21.08,42.95 v21.46,42.93 | 21.46,43.84 21.12,43.09 | 21.12,43.09 | 21.46,43.84 21.12,43.09 | v21.46,42.93 21.12,43.09 | 21.46,43.84 21.81,43.09 | 21.81,43.09 | v21.46,42.93 21.81,43.09 | 21.46,43.84 21.12,43.09 | 21.46,43.84 21.81,43.09 | 21.46,43.84 21.12,43.09 | v21.46,42.93 21.12,43.09 | 21.46,43.84 21.81,43.09 | v21.46,42.93 21.81,43.09 | 11.02,45.37 | 10.26,45.72 | 10.26,45.72 11.02,45.37 | v11.18,45.72 11.02,45.37 | 10.26,45.72 | 10.26,45.72 11.02,46.07 | 11.02,46.07 | 10.26,45.72 | 10.26,45.72 11.02,46.07 | v11.18,45.72 11.02,46.07 | 12.09,45.72 | 12.09,45.72 11.34,46.07 | v11.18,45.72 11.34,46.07 | 12.09,45.72 | 12.09,45.72 11.34,45.37 | 11.34,45.37 | 12.09,45.72 | 12.09,45.72 11.34,45.37 | v11.18,45.72 11.34,45.37 | 10.26,45.72 11.02,45.37 | 11.02,45.37 | 10.26,45.72 11.02,45.37 | v11.18,45.72 11.02,45.37 | 10.26,45.72 11.02,46.07 | 11.02,46.07 | v11.18,45.72 11.02,46.07 | 10.26,45.72 11.02,45.37 | 10.26,45.72 11.02,46.07 | 10.26,45.72 11.02,45.37 | v11.18,45.72 11.02,45.37 | 10.26,45.72 11.02,46.07 | v11.18,45.72 11.02,46.07 | 12.09,45.72 11.34,45.37 | 11.34,45.37 | 12.09,45.72 11.34,46.07 | 11.34,46.07
  Bottom 0.254: v11.18,45.72 11.34,46.07 | 12.09,45.72 11.34,45.37 | v11.18,45.72 11.34,45.37 | 12.09,45.72 11.34,46.07 | v11.18,45.72 11.34,46.07 | 12.09,45.72 11.34,45.37 | v11.18,45.72 11.34,45.37 | STM.11 24.42,34.96 v25.02,35.56 | STM.22 24.07,29.46 v24.95,28.58 | 21.04,37.46 14.87,37.46 | C18.1 8.7,26.73 9.04,27.07 | v24.95,30.86 24.86,30.96 STM.19 18.77,30.96 17.78,29.97 | 14.99,37.34 14.99,32.77 17.78,29.97 | U1.12 23.61,20.18 v23.62,20.07 23.62,22.25 23.44,22.43 | 17.78,29.97 17.78,27.3 | 17.78,27.3 19.69,27.3 20.04,26.95 STM.28 20.04,24.92 20.32,24.64 21.59,24.64 23.44,22.78 23.44,22.43 | 22.76,23.11 C4.+ 23.44,22.43
  other vias: 6.98,26.73
  pour Top (isolate 0.508, no thermals): 4.95,15.88 14.61,15.88 14.73,16 14.73,13.08 15.88,11.94 17.02,11.94 18.16,13.08 18.16,18.16 4.95,18.16
+5V  (2 unrouted)
  pour Top (isolate 0.508, no thermals): 14.73,2.54 14.73,3.43 13.46,4.45 7.24,4.45 5.59,6.1 7.75,6.1 8.51,5.33 18.8,5.33 19.56,6.1 19.56,9.78 19.81,10.03 21.08,10.03 21.97,9.14 21.97,6.1 20.32,4.45 17.27,4.45 16,3.43 16,2.54
ADC12_IN1
  Bottom 0.254: STM.15 24.7,32.96 28.51,29.15 C21.2 28.32,24.07 R23.2
BOOT0
  Bottom 0.254: STM.94 18.04,43.05 17.65,43.43 12.83,43.43 11.56,44.7 6.56,44.7 R7.2
BT_KEY  (via drill 0.61)  (2 unrouted)
  Top 0.254: v23.75,4.57 v27.43,4.57
  Bottom 0.254: U1.34 7.24,7.32 7.24,5.71 7.87,5.08 11.68,5.08 12.19,4.57 v23.75,4.57 | 29.21,4.57 29.84,5.21
BUTTONA  (via drill 0.61)
  Top 0.254: C7.1 24.92,9.02 24.21,9.73 | 24.21,9.73 S4.P$2 | v12.83,22.61 16.51,18.92 18.42,18.92 18.92,18.41 18.92,14.48 23.5,9.91 24.26,9.91 24.21,9.86 24.21,9.73
  Bottom 0.254: STM.31 18.54,23.49 17.14,22.1 13.34,22.1 v12.83,22.61
BUTTONB  (via drill 0.61)
  Top 0.254: C25.1 28.3,17.02 S2.P$2 29.08,15.24 26.8,12.95 21.97,12.95 19.43,15.49 19.43,18.67 18.54,19.56 17.78,19.56 v14.22,23.11
  Bottom 0.254: STM.32 18.04,23.76 16.89,22.61 14.73,22.61 v14.22,23.11
GND  (via drill 0.61)  (3 unrouted)
  Top 0.254: 6.6,51.47 C39.2 7.91,50.17 IC4.9 | IC5.11 21.97,47.24 22.08,47.24 | 14.13,51.98 IC4.1 13.7,52.44 14.1,52.83 | v22.86,45.59 22.35,46.1 22.1,46.1 | 22.1,46.1 21.45,46.1 IC5.9 | 22.08,47.24 22.1,47.24 v22.73,47.88 | IC4.11 10.31,49.13 10.29,49.15 9.65,49.15 9.27,48.77 9.27,47.65 | IC4.18 13.7,47.61 | 13.7,47.61 13.7,46.63 13.45,46.38 | 13.45,46.38 C38.2 | 9.27,47.65 9.27,47.62 | 13.45,46.38 13.91,47.07 | 13.91,47.07 | 22.1,46.1 22.54,45.39 v22.86,45.59 | 22.1,46.1 22.92,45.97 v22.86,45.59 | 22.08,47.24 22.86,47.52 v22.73,47.88 | 22.08,47.24 22.38,48.02 v22.73,47.88 | 13.45,46.38 | 13.45,46.38 13.91,47.07 | v14.22,46.86 13.91,47.07 | 13.7,47.61 13.85,46.8 v14.22,46.86 | 13.7,47.61 14.42,47.19 v14.22,46.86 | 13.45,46.38 14.27,46.48 | 14.27,46.48 | v14.22,46.86 14.27,46.48 | 13.45,46.38 13.91,47.07 | v14.22,46.86 13.91,47.07 | 13.45,46.38 14.27,46.48 | v14.22,46.86 14.27,46.48 | 13.45,46.38 13.91,47.07 | v14.22,46.86 13.91,47.07 | 9.27,47.65 9.55,46.86 v9.91,46.99 10.05,47.34 9.27,47.65
  Top 0.508: SDCARD2.6 8.75,34.28 v8.89,34.42
  Bottom 0.254: 22.11,30.46 21.95,30.46 21.72,30.23 21.08,30.23 | 22.11,30.46 STM.20 | STM.74 8.3,39.46 8.31,39.44 | 8.31,39.44 8.89,38.86 | STM.99 20.54,40.86 20.19,40.51 20.14,40.51 | STM.10 21.87,35.46 21.86,35.45 | 21.86,35.45 | 21.86,35.45 v21.21,34.8 | 19.69,40.51 v19.3,40.13 | 19.69,40.51 19.3,40.51 v19.3,40.13 | 21.86,35.45 21.08,35.16 | v21.21,34.8 21.08,35.16 | 21.86,35.45 21.57,34.66 | v21.21,34.8 21.57,34.66 | v21.21,34.8 21.37,35.14 | 21.86,35.45 21.08,35.16 | v21.21,34.8 21.08,35.16 | 21.86,35.45 21.57,34.66 | v21.21,34.8 21.57,34.66 | 22.11,30.46 21.56,30.24 v20.7,29.84 | 8.31,39.44 8.52,38.64 v8.89,38.73 9.06,39.08 8.31,39.44 | 20.14,40.51 19.69,40.51 | 20.14,40.51 19.59,39.88 v19.3,40.13 | 22.54,24.64 22.92,24.77 | STM.27 20.54,27.47 19.94,28.07 19.94,28.32 v19.81,28.45
  other vias: 21.21,36.2 16,38.73 19.3,38.73 17.65,38.73 16,40.13 17.65,40.13 24.89,41.91 22.86,50.29 6.35,50.16 10.41,38.73 11.94,38.73 26.03,49.66 14.22,52.45 6.35,48.51 16.13,33.4 17.91,36.2 19.56,36.2 14.35,40.13 8.89,37.21 8.89,33.02 8.89,35.81 10.29,30.61 11.81,30.61 13.72,32.51 13.72,34.04 24.89,40.39 8.13,3.56 24.38,45.47 15.49,46.86 19.05,29.59 26.42,24.51 24.77,24.51 8,24.64 22.99,24.51 4.7,46.74
  pour Bottom (isolate 0.508, rank 6, no thermals): -10.03,19.05 -10.03,54.1 32.89,54.1 33.02,-0.25 3.05,-0.25 -10.41,-0.89 -10.41,6.73
  pour Top (isolate 0.508, rank 6, no thermals): -7.24,-12.32 33.02,-7.62 33.02,53.85 -2.29,53.85
I2C1_SCL  (via drill 0.61)
  Top 0.254: IC4.23 | v17.27,50.67 17.91,50.67 18.15,50.43 | IC5.1 18.57,50.01 18.15,50.43 | IC4.23 16.36,50.67 | 16.36,50.67 v17.27,50.67 | 16.36,50.67 17.11,50.33 | 17.11,50.33 | 16.36,50.67 | 16.36,50.67 17.11,50.33 | v17.27,50.67 17.11,50.33 | 16.36,50.67 | 16.36,50.67 17.11,51.02 | 17.11,51.02 | 16.36,50.67 | 16.36,50.67 17.11,51.02 | v17.27,50.67 17.11,51.02 | 18.15,50.43 17.52,50.96 v17.27,50.67 | 18.15,50.43 17.33,50.3 v17.27,50.67 | 16.36,50.67 17.11,50.33 | 17.11,50.33 | 16.36,50.67 17.11,50.33 | v17.27,50.67 17.11,50.33 | 16.36,50.67 17.11,51.02 | 17.11,51.02 | v17.27,50.67 17.11,51.02 | 16.36,50.67 17.11,50.33 | 16.36,50.67 17.11,51.02 | 16.36,50.67 17.11,50.33 | v17.27,50.67 17.11,50.33 | 16.36,50.67 17.11,51.02 | v17.27,50.67 17.11,51.02
  Bottom 0.254: STM.95 18.54,44.45 | 18.54,44.45 18.54,46.48 21.08,49.02 21.08,50.04 20.45,50.67 18.19,50.67 | 18.19,50.67 v17.27,50.67 | R10.1 18.54,44.45 | 18.19,50.67 | 18.19,50.67 17.43,51.02 | 17.43,51.02 | 18.19,50.67 | 18.19,50.67 17.43,51.02 | v17.27,50.67 17.43,51.02 | 18.19,50.67 | 18.19,50.67 17.43,50.33 | 17.43,50.33 | 18.19,50.67 | 18.19,50.67 17.43,50.33 | v17.27,50.67 17.43,50.33 | 18.19,50.67 17.43,50.33 | 17.43,50.33 | 18.19,50.67 17.43,51.02 | 17.43,51.02 | v17.27,50.67 17.43,51.02 | 18.19,50.67 17.43,50.33 | v17.27,50.67 17.43,50.33 | 18.19,50.67 17.43,51.02 | v17.27,50.67 17.43,51.02 | 18.19,50.67 17.43,50.33 | v17.27,50.67 17.43,50.33
I2C1_SDA  (via drill 0.61)
  Top 0.254: v19.05,51.56 18.3,51.56 | IC4.24 14.99,51.18 15.37,51.56 18.14,51.56 | IC5.16 19.19,50.66 | 19.19,50.66 | v19.05,51.56 18.14,51.56 | 19.19,50.66 19.2,50.65 19.2,50.66 | 19.2,50.66 19.2,51.41 v19.05,51.56 | 18.14,51.56 | 18.14,51.56 18.89,51.22 | 18.14,51.56 18.89,51.91 | 18.89,51.91 | v19.05,51.56 18.89,51.91 | 18.14,51.56 | 18.14,51.56 18.89,51.22 | 18.89,51.22 | 18.14,51.56 | 19.19,50.66 19.42,51.46 v19.05,51.56 | 19.19,50.66 18.73,51.35 | v19.05,51.56 18.73,51.35 | 18.14,51.56 18.89,51.22 | 18.89,51.22 | v19.05,51.56 18.89,51.22 | 18.14,51.56 18.89,51.91 | 18.14,51.56 18.89,51.22 | v19.05,51.56 18.89,51.22 | 18.14,51.56 18.89,51.91 | 18.89,51.91 | v19.05,51.56 18.89,51.91 | 18.14,51.56 18.89,51.22 | v19.05,51.56 18.89,51.22 | 18.14,51.56 18.89,51.91 | v19.05,51.56 18.89,51.91 | 19.19,50.66 19.42,51.46 v19.05,51.56 | 19.19,50.66 18.73,51.35 | v19.05,51.56 18.73,51.35 | 19.2,50.66 19.42,51.46 v19.05,51.56 | 19.2,50.66 18.73,51.35 v19.05,51.56
  Bottom 0.254: STM.96 19.04,44.45 | 19.04,44.45 19.04,46.22 21.59,48.77 21.59,50.29 20.32,51.56 19.96,51.56 | 19.96,51.56 | 19.96,51.56 v19.05,51.56 | 19.2,51.56 v19.05,51.56 | R11.1 19.04,44.45 | 19.96,51.56 19.21,51.91 | 19.21,51.91 | v19.05,51.56 19.21,51.91 | 19.96,51.56 19.21,51.22 | 19.21,51.22 | 19.96,51.56 19.21,51.91 | 19.21,51.91 | 19.96,51.56 19.21,51.91 | v19.05,51.56 19.21,51.91 | 19.96,51.56 | 19.21,51.22 | v19.05,51.56 19.21,51.22 | 19.96,51.56 19.21,51.91 | 19.96,51.56 | 19.96,51.56 19.21,51.22 | v19.05,51.56 19.21,51.22 | 19.96,51.56 19.21,51.91 | v19.05,51.56 19.21,51.91 | 19.96,51.56 19.21,51.22 | v19.05,51.56 19.21,51.22
I2C2_SCL  (via drill 0.61)
  Top 0.254: 20.32,20.32 IC2.6 20.32,22.99 19.05,24.26 v16.89,24.26 16.51,24.64 12.45,24.64 9.65,21.84 R15.2
  Bottom 0.254: STM.47 10.54,25.02 10.92,24.64 16.51,24.64 v16.89,24.26
I2C2_SDA  (via drill 0.61)
  Top 0.254: IC2.5 19.05,22.61 16.64,22.61 v15.62,23.62 15.11,24.13 12.7,24.13 11.68,23.11 R16.1
  Bottom 0.254: STM.48 10.04,24.76 10.67,24.13 15.11,24.13 v15.62,23.62
N$1
  Top 0.254: C1.1 25.65,34.14 Y1.2
  Bottom 0.254: STM.12 25.97,34.46 Y1.2
N$2
  Top 0.254: U$12.B+ 28.85,20.26 R2.1
N$3
  Top 0.254: IC4.10 8.57,49.63 C26.1
N$4  (via drill 0.61)
  Top 0.254: v25.15,5.46 v28.58,5.46 | v29.59,42.04 LD1.A
  Bottom 0.254: v29.59,42.04 29.97,41.66 29.97,6.86 v28.58,5.46 | U1.31 11.61,6.17 12.32,5.46 v25.15,5.46
N$5  (1 unrouted)
N$6
  Top 0.254: U$12.R+ 25.25,20.26 R6.1
N$7
  Top 0.254: U$12.G+ R3.1
N$8
  Top 0.254: IC4.20 16.02,49.13 C36.1
N$10
  Top 0.254: IC5.8 20.69,44.59 21.34,43.94 C27.1
N$11
  Top 0.254: LD2.C R1.1
N$12
  Top 0.254: IC5.10 23.98,46.74 C28.+
N$13
  Top 0.254: IC5.12 21.31,48.49 21.84,49.02 25.02,49.02 25.65,48.39 25.65,44.62 C27.2
N$27  (via drill 0.61)  (3 unrouted)
  Bottom 0.254: R23.1 28.19,20.74 28.83,20.11 28.83,7.75
  other vias: 37.97,-1.65
N$29
  Top 0.254: C20.1 28.04,32.41 Y1.1
  Bottom 0.254: STM.13 26.49,33.96 Y1.1
N$31  (via drill 0.61)
  Top 0.254: C17.1 4.83,38.73 v4.57,38.99
  Bottom 0.254: STM.73 4.6,38.96 v4.57,38.99
N$32
  Bottom 0.254: STM.49 9.54,24.5 10.48,23.56 C15.1
RGB_CH1  (via drill 0.61)
  Top 0.254: v25.02,26.29 25.25,26.18 U$12.R-
  Bottom 0.254: STM.23 21.59,28.96 21.08,28.45 21.08,27.56 22.1,26.54 25.02,26.54 v25.02,26.29
RGB_CH2  (via drill 0.61)
  Top 0.254: U$12.G- v27.05,26.92
  Bottom 0.254: STM.24 21.85,28.46 21.59,28.19 21.59,27.81 22.35,27.05 26.03,27.05 v27.05,26.92
RGB_CH3  (via drill 0.61)
  Top 0.254: U$12.B- 28.85,27.41 v26.42,29.84
  Bottom 0.254: STM.25 23.44,27.56 25.4,27.56 26.42,28.58 v26.42,29.84
SDIO_CLK  (via drill 0.61)
  Top 0.254: SDCARD2.5 7.21,33.18 8.64,31.75 8.64,26.8 7.62,25.78 v3.17,25.78
  Bottom 0.254: STM.80 11.04,43.19 10.54,43.69 4.19,43.69 1.52,41.02 1.52,27.43 v3.17,25.78
SDIO_CMD  (via drill 0.61)
  Top 0.254: SDCARD2.3 2.79,30.98 1.71,32.06 | 1.71,32.06 1.4,32.38 1.4,38.61 2.29,39.5 2.29,43.18 v3.3,44.2 | 1.71,32.07 1.71,32.06
  Bottom 0.254: STM.83 12.54,42.96 11.3,44.2 v3.3,44.2
SDIO_D0  (via drill 0.61)
  Top 0.254: SDCARD2.7 4.63,35.38 v4.57,35.43
  Bottom 0.254: STM.65 5.05,34.96 v4.57,35.43
SDIO_D1  (via drill 0.61)
  Top 0.254: v5.33,36.83 6.03,36.45 SDCARD2.8
  Bottom 0.254: STM.66 5.95,35.46 5.59,35.81 5.59,36.32 v5.33,36.83
SDIO_D2  (via drill 0.61)
  Top 0.254: SDCARD2.1 4.88,28.78 v3.68,29.97
  Bottom 0.254: STM.78 10.04,40.9 9.65,40.51 8.51,40.51 7.24,41.78 4.57,41.78 3.05,40.26 3.05,30.61 v3.68,29.97
SDIO_D3  (via drill 0.61)
  Top 0.254: SDCARD2.2 6.7,29.88 7.24,29.34 7.24,28.32 6.73,27.81 v3.05,27.81
  Bottom 0.254: STM.79 10.54,42.93 10.29,43.18 4.45,43.18 2.03,40.77 2.03,28.83 v3.05,27.81
SDIO_DETECT  (via drill 0.61)
  Top 0.254: v16,29.84 16.13,29.97 SDCARD2.CD2
  Bottom 0.254: STM.54 15.61,29.46 v16,29.84
SW-!RESET
  Top 0.254: S1.P$2 1.52,6.35 7.24,0.63 18.54,0.63 19.3,1.4 | JP4.5 19.3,1.4 | C13.1 19.3,1.4
  Bottom 0.254: STM.14 24.96,33.46 29.39,29.03 29.39,7.55 24.38,2.54 JP4.5
SW_CLK
  Bottom 0.254: STM.76 8.58,42.42 4.45,42.42 2.54,40.51 2.54,29.72 4.19,28.07 4.19,22.73 5.46,21.46 5.46,4.45 9.02,0.89 16,0.89 JP4.4
SW_DIO
  Bottom 0.254: STM.72 5.56,38.46 3.56,36.45 3.56,32.13 4.7,30.99 4.7,22.99 5.97,21.72 5.97,6.22 7.62,4.57 10.8,4.57 JP4.2
USART3_RX
  Bottom 0.254: STM.56 5.69,30.46 5.21,29.97 5.21,23.37 7.11,21.46 U1.1
USART3_TX
  Bottom 0.254: STM.55 5.95,29.96 5.72,29.72 5.72,23.88 8.61,20.98 U1.2

### Text on the board
tNames: vnd241092@gmail.com
bNames: Y | X